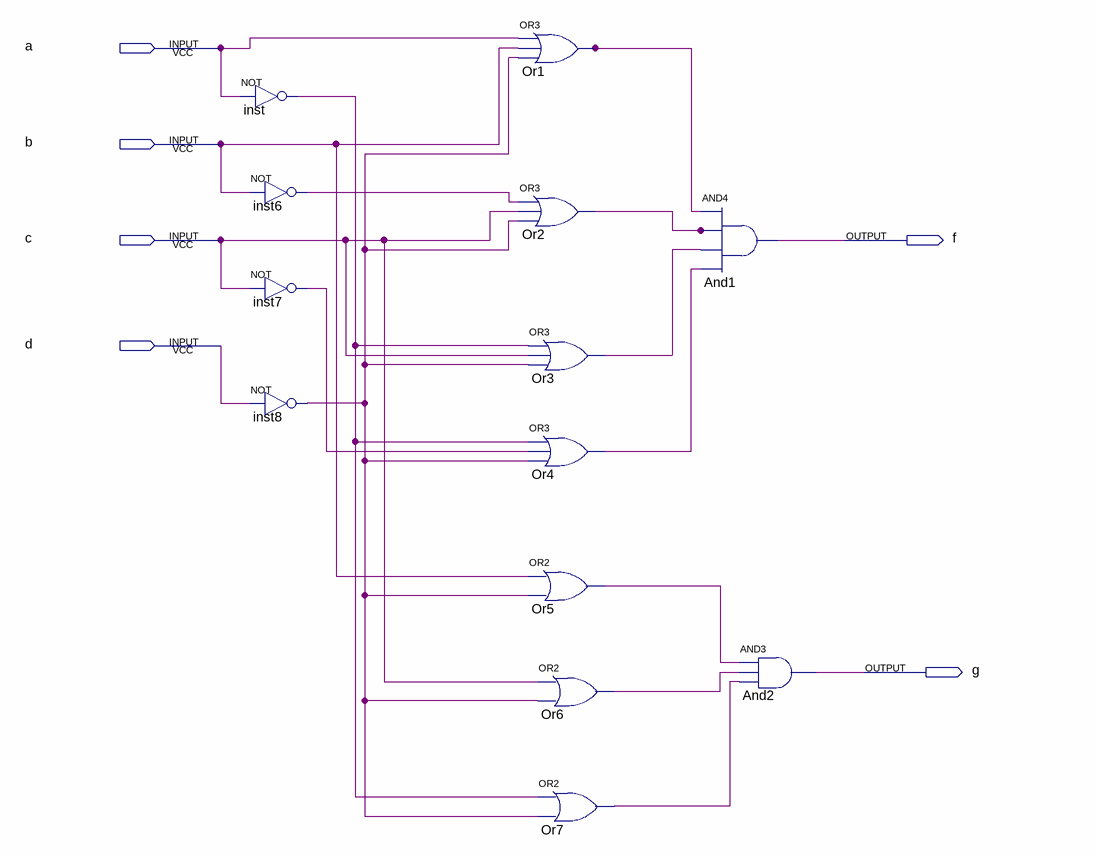
[diagram p0: schematic sheet]
// Quartus schematic Lab1Q2.bdf as structural Verilog: 13 symbols, 6 pins
module Lab1Q2 (
  input  a,
  input  b,
  input  c,
  input  d,
  output f,
  output g
);

  wire inst6_out, inst7_out, inst8_out, inst_out, Or1_out, Or2_out, Or3_out, Or4_out, Or5_out, Or6_out,
       Or7_out;

  not inst (inst_out, a);
  not inst6 (inst6_out, b);
  not inst7 (inst7_out, c);
  not inst8 (inst8_out, d);
  or Or1 (Or1_out, a, b, inst8_out);
  or Or2 (Or2_out, inst6_out, c, inst8_out);
  or Or3 (Or3_out, inst_out, c, inst8_out);
  or Or4 (Or4_out, inst_out, inst7_out, inst8_out);
  or Or5 (Or5_out, b, inst8_out);
  or Or6 (Or6_out, c, inst8_out);
  or Or7 (Or7_out, inst_out, inst8_out);
  and And1 (f, Or1_out, Or2_out, Or3_out, Or4_out);
  and And2 (g, Or5_out, Or6_out, Or7_out);
endmodule
